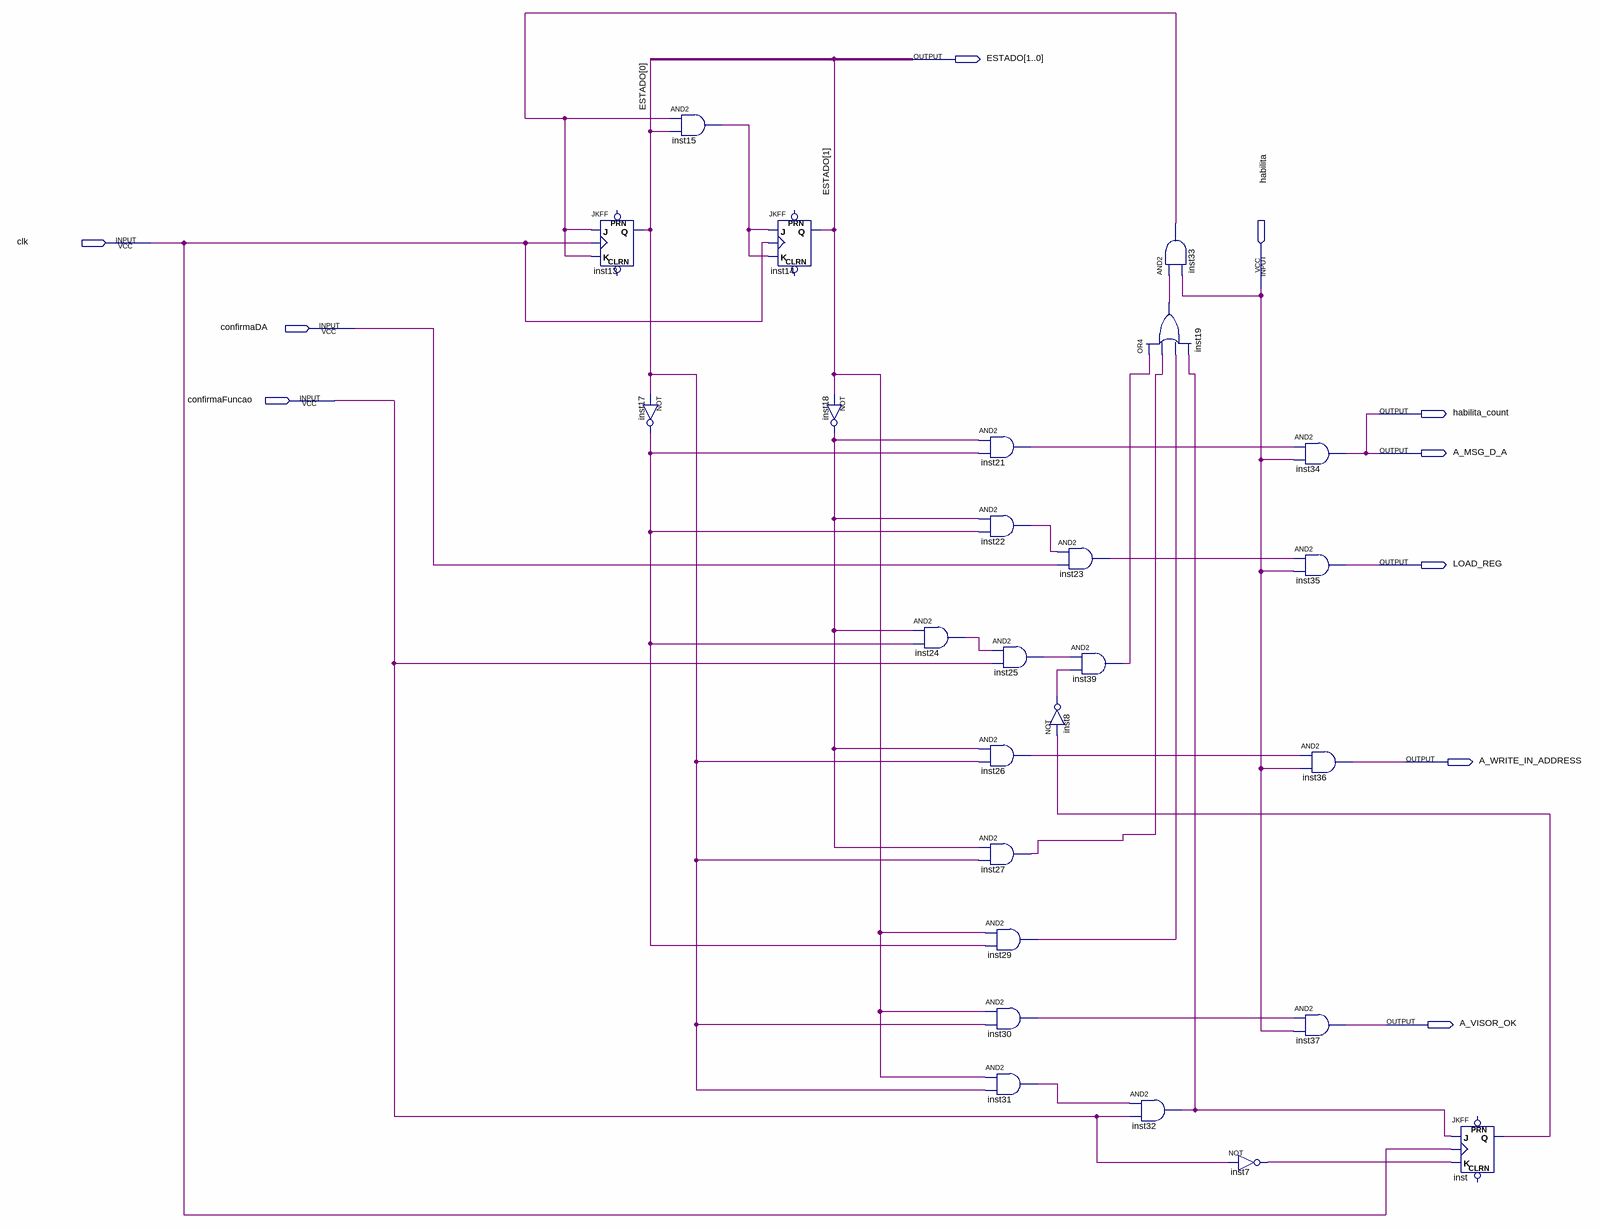
[diagram p0: schematic sheet]
// Quartus schematic MAQUINA_A.bdf as structural Verilog: 26 symbols, 10 pins
module MAQUINA_A (
  input  clk,
  input  habilita,
  input  confirmaDA,
  input  confirmaFuncao,
  output [1:0] ESTADO,
  output habilita_count,
  output A_MSG_D_A,
  output LOAD_REG,
  output A_WRITE_IN_ADDRESS,
  output A_VISOR_OK
);

  wire inst7_out, inst8_out, inst15_out, inst17_out, inst18_out, inst19_out, inst21_out, inst22_out,
       inst23_out, inst24_out, inst25_out, inst26_out, inst27_out, inst29_out, inst30_out, inst31_out,
       inst32_out, inst33_out, inst39_out, inst_q;

  JKFF inst13 (.K(inst33_out), .J(inst33_out), .CLK(clk), .Q(ESTADO[0]));  // open: PRN, CLRN
  and inst15 (inst15_out, inst33_out, ESTADO[0]);
  not inst17 (inst17_out, ESTADO[0]);
  JKFF inst14 (.K(inst15_out), .J(inst15_out), .CLK(clk), .Q(ESTADO[1]));  // open: PRN, CLRN
  not inst18 (inst18_out, ESTADO[1]);
  and inst24 (inst24_out, inst18_out, inst17_out);
  and inst21 (inst21_out, inst18_out, inst17_out);
  and inst22 (inst22_out, inst18_out, inst17_out);
  and inst26 (inst26_out, inst18_out, ESTADO[0]);
  and inst27 (inst27_out, inst18_out, ESTADO[0]);
  and inst29 (inst29_out, ESTADO[1], inst17_out);
  and inst30 (inst30_out, ESTADO[1], ESTADO[0]);
  and inst31 (inst31_out, ESTADO[1], ESTADO[0]);
  and inst25 (inst25_out, inst24_out, confirmaFuncao);
  and inst23 (inst23_out, inst22_out, confirmaDA);
  and inst39 (inst39_out, inst25_out, inst8_out);
  not inst8 (inst8_out, inst_q);
  or inst19 (inst19_out, inst39_out, inst27_out, inst29_out, inst32_out);
  and inst32 (inst32_out, inst31_out, confirmaFuncao);
  and inst33 (inst33_out, inst19_out, habilita);
  not inst7 (inst7_out, confirmaFuncao);
  and inst34 (A_MSG_D_A, inst21_out, habilita);
  and inst35 (LOAD_REG, inst23_out, habilita);
  and inst36 (A_WRITE_IN_ADDRESS, inst26_out, habilita);
  and inst37 (A_VISOR_OK, inst30_out, habilita);
  JKFF inst (.K(inst7_out), .J(inst32_out), .CLK(clk), .Q(inst_q));  // open: PRN, CLRN

  assign habilita_count = A_MSG_D_A;
endmodule
